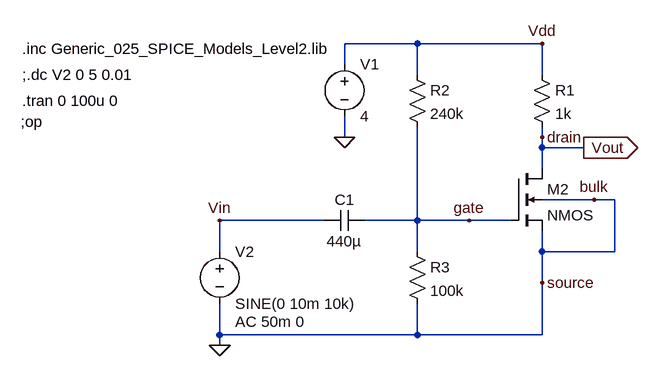
[diagram p0: schematic circuito_1.asc]
circuito_1.asc, the LTspice schematic file:
Version 4
SHEET 1 2972 680
WIRE -32 -128 -144 -128
WIRE 160 -128 -32 -128
WIRE -144 -96 -144 -128
WIRE -32 -80 -32 -128
WIRE 160 -80 160 -128
WIRE -144 16 -144 -16
WIRE 160 16 160 0
WIRE 160 32 160 16
WIRE 224 32 160 32
WIRE 160 64 160 32
WIRE 240 112 160 112
WIRE 272 112 240 112
WIRE -176 144 -336 144
WIRE -32 144 -32 0
WIRE -32 144 -112 144
WIRE 48 144 -32 144
WIRE 112 144 48 144
WIRE -336 192 -336 144
WIRE -32 192 -32 144
WIRE 160 192 160 160
WIRE 272 192 272 112
WIRE 272 192 160 192
WIRE 160 240 160 192
WIRE -336 320 -336 272
WIRE -32 320 -32 272
WIRE -32 320 -336 320
WIRE 160 320 160 240
WIRE 160 320 -32 320
WIRE -336 336 -336 320
FLAG -144 16 0
FLAG -336 336 0
FLAG 224 32 Vout
IOPIN 224 32 Out
FLAG -336 144 Vin
FLAG 160 -128 Vdd
FLAG 160 240 source
FLAG 160 16 drain
FLAG 48 144 gate
FLAG 240 112 bulk
SYMBOL voltage -144 -112 R0
WINDOW 123 0 0 Left 2
WINDOW 39 0 0 Left 2
SYMATTR InstName V1
SYMATTR Value 4
SYMBOL voltage -336 176 R0
WINDOW 123 24 124 Left 2
WINDOW 39 0 0 Left 2
SYMATTR Value2 AC 50m 0
SYMATTR InstName V2
SYMATTR Value SINE(0 10m 10k)
SYMBOL res 144 -96 R0
SYMATTR InstName R1
SYMATTR Value 1k
SYMBOL nmos4 112 64 R0
SYMATTR InstName M2
SYMATTR Value2 l=0.25u w=40u
SYMBOL res -48 -96 R0
SYMATTR InstName R2
SYMATTR Value 240k
SYMBOL cap -112 128 R90
WINDOW 0 0 32 VBottom 2
WINDOW 3 32 32 VTop 2
SYMATTR InstName C1
SYMATTR Value 440µ
SYMBOL res -48 176 R0
SYMATTR InstName R3
SYMATTR Value 100k
TEXT -640 -120 Left 2 !.inc Generic_025_SPICE_Models_Level2.lib
TEXT -640 -80 Left 2 !;.dc V2 0 5 0.01
TEXT -642 -8 Left 2 !;op
TEXT -640 -40 Left 2 !.tran 0 100u 0

The netlist it stands for:
* circuito_1.asc
V1 Vdd 0 4
V2 Vin 0 SINE(0 10m 10k) AC 50m 0
R1 Vdd drain 1k
M2 drain gate 0 0 NMOS l=0.25u w=40u
R2 Vdd gate 240k
C1 gate Vin 440µ
R3 gate 0 100k
.model NMOS NMOS
.model PMOS PMOS
.lib standard.mos
.inc Generic_025_SPICE_Models_Level2.lib
;.dc V2 0 5 0.01
;op
.tran 0 100u 0
.backanno
.end